# EAGLE design Warble PitchBird (EAGLE 9.6.0)
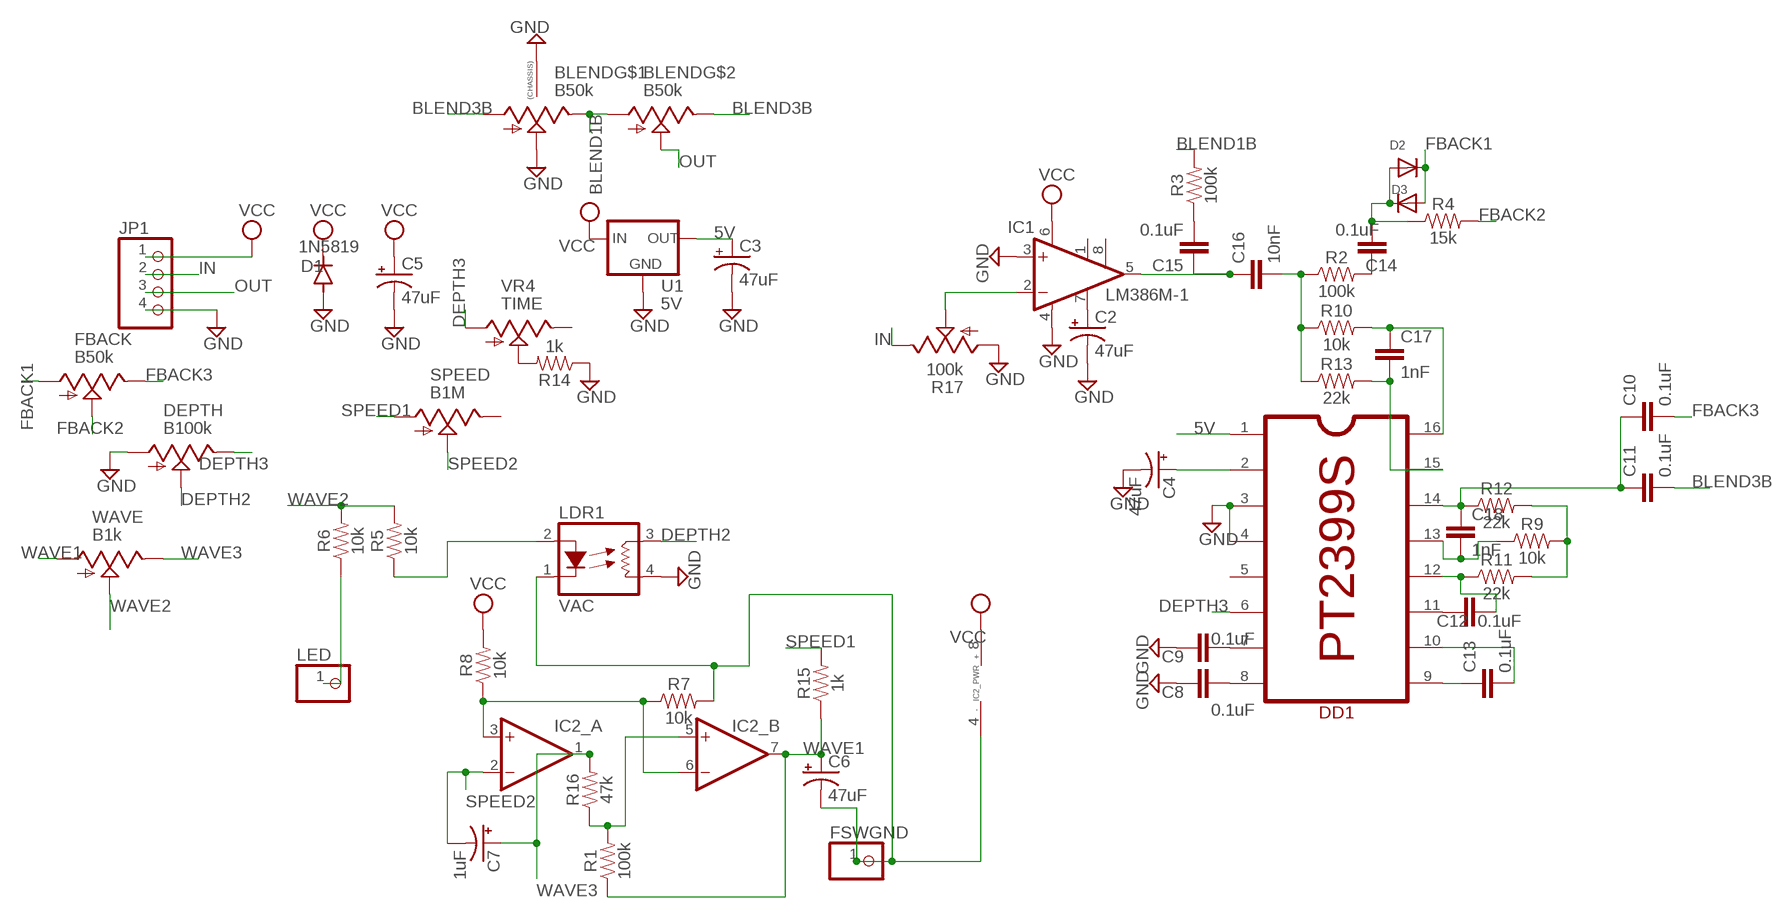
[diagram p0: schematic, sheet 1]

## Parts
BLEND  B50k  ALPHA-9MM-DUALPOT  [DUAL_9MM_SNAP-IN_POT]
C2  47uF  CAP_SMD+THRUPAN_B  [PAN_B_SMD+THRU]
C3  47uF  CAP_SMD+THRUPAN_B  [PAN_B_SMD+THRU]
C4  47uF  CAP_SMD+THRUPAN_B  [PAN_B_SMD+THRU]
C5  47uF  CAP_SMD+THRUPAN_B  [PAN_B_SMD+THRU]
C6  47uF  CAP_SMD+THRUPAN_B  [PAN_B_SMD+THRU]
C7  1uF  CAP_SMD+THRUPAN_B  [PAN_B_SMD+THRU]
C8  0.1uF  0.1UF-0603-25V-5%  [0603]
C9  0.1uF  0.1UF-0603-25V-5%  [0603]
C10  0.1uF  0.1UF-0603-25V-5%  [0603]
C11  0.1uF  0.1UF-0603-25V-5%  [0603]
C12  0.1uF  0.1UF-0603-25V-5%  [0603]
C13  0.1uF  0.1UF-0603-25V-5%  [0603]
C14  0.1uF  0.1UF-0603-25V-5%  [0603]
C15  0.1uF  0.1UF-0603-25V-5%  [0603]
C16  10nF  10NF-0603-50V-10%  [0603]
C17  1nF  1.0NF/1000PF-0603-50V-10%  [0603]
C18  1nF  1.0NF/1000PF-0603-50V-10%  [0603]
D1  1N5819  DIODE-SOD123  [SOD123]
D2  DIODESOD-123  [SOD-123]
D3  DIODESOD-123  [SOD-123]
DD1  PT2399S  [SO-16]
DEPTH  B100k  9MM_SNAP-IN_POT_  [9MM_SNAP-IN_POT]
FBACK  B50k  9MM_SNAP-IN_POT_  [9MM_SNAP-IN_POT]
FSWGND  PINHD-1X1  [1X01]
IC1  LM386M-1  [SO08]
IC2  DUALSMD  [SO08]
JP1  PINHD-1X4  [1X04]
LDR1  VAC  VACTROL_4PIN  [VACTROL_4PIN_VTL5C]
LED  PINHD-1X1  [1X01]
R1  100k  100KOHM-0603-1/10W-1%  [0603]
R2  100k  100KOHM-0603-1/10W-1%  [0603]
R3  100k  100KOHM-0603-1/10W-1%  [0603]
R4  15k  15KOHM-0603-1/10W-1%  [0603]
R5  10k  10KOHM-0603-1/10W-1%  [0603]
R6  10k  10KOHM-0603-1/10W-1%  [0603]
R7  10k  10KOHM-0603-1/10W-1%  [0603]
R8  10k  10KOHM-0603-1/10W-1%  [0603]
R9  10k  10KOHM-0603-1/10W-1%  [0603]
R10  10k  10KOHM-0603-1/10W-1%  [0603]
R11  22k  22KOHM-0603-1/10W-1%  [0603]
R12  22k  22KOHM-0603-1/10W-1%  [0603]
R13  22k  22KOHM-0603-1/10W-1%  [0603]
R14  1k  1KOHM-0603-1/10W-1%  [0603]
R15  1k  1KOHM-0603-1/10W-1%  [0603]
R16  47k  47KOHM-0603-1/10W-1%  [0603]
R17  100k  TRIM_US-PT10  [PT-10]
SPEED  B1M  9MM_SNAP-IN_POT_  [9MM_SNAP-IN_POT]
U1  5V  V_REG_78XX7812  [TO-252]
VR4  TIME  9MM_SNAP-IN_POT_  [9MM_SNAP-IN_POT]
WAVE  B1k  9MM_SNAP-IN_POT_  [9MM_SNAP-IN_POT]

## Nets
5V: C3.+ C3.++(+) DD1.1 U1.2(OUT)
BLEND1B: BLEND.1B(A) BLEND.3(E) R3.2
BLEND3B: BLEND.1(A) BLEND.3B(E) C11.2
DEPTH2: DEPTH.2(S) LDR1.3(RES1)
DEPTH3: DD1.6 DEPTH.3(E) VR4.1(A)
FBACK1: D2.C D3.A FBACK.1(A)
FBACK2: FBACK.2(S) R4.2
FBACK3: C10.2 FBACK.3(E)
GND: BLEND.2(S) BLEND.CHASSIS1 BLEND.CHASSIS2 C2.- C2.--(-) C3.- C3.--(-) C4.- C4.--(-) C5.- C5.--(-) C8.1 C9.1 D1.A DD1.3 DD1.4 DEPTH.1(A) IC1.3(+IN) IC1.4(GND) JP1.4 LDR1.4(RES2) R14.1 R17.A U1.3(GND)
IN: JP1.2 R17.E
N$1: C4.+ C4.++(+) DD1.2
N$2: LED.1 R6.1
N$3: C16.2 R2.1 R10.1 R13.1
N$4: IC1.2(-IN) R17.S
N$5: R14.2 VR4.2(S)
N$6: C2.+ C2.++(+) IC1.7(BYPASS)
N$7: C15.1 C16.1 IC1.5(OUT)
N$8: C15.2 R3.1
N$9: C17.1 DD1.16 R10.2
N$10: C17.2 DD1.15 R13.2
N$11: C14.1 R2.2
N$12: C14.2 D2.A D3.C R4.1
N$13: C13.1 DD1.9
N$14: C13.2 DD1.10
N$15: C12.1 DD1.11
N$16: C8.2 DD1.8
N$17: R9.2 R11.2 R12.2
N$18: C10.1 C11.1 C18.1 DD1.14 R12.1
N$19: C18.2 DD1.13 R9.1
N$20: C12.2 DD1.12 R11.1
N$21: C9.2 DD1.7
N$22: IC2.3(_A:+IN) IC2.6(_B:-IN) R7.1 R8.1
N$24: IC2.5(_B:+IN) R1.2 R16.1
N$25: LDR1.2(LED+) R5.1
N$28: C6.- C6.--(-) FSWGND.1 IC2.4(_PWR:V-) LDR1.1(LED-) R7.2
OUT: BLEND.2B(S) JP1.3
SPEED1: R15.2 SPEED.1(A)
SPEED2: C7.- C7.--(-) IC2.2(_A:-IN) SPEED.2(S)
VCC: C5.+ C5.++(+) D1.C IC1.6(VS) IC2.8(_PWR:V+) JP1.1 R8.2 U1.1(IN)
WAVE1: C6.+ C6.++(+) IC2.7(_B:OUT) R1.1 R15.1 WAVE.1(A)
WAVE2: R5.2 R6.2 WAVE.2(S)
WAVE3: C7.+ C7.++(+) IC2.1(_A:OUT) R16.2 WAVE.3(E)
Unconnected: DD1.5 IC1.1(GAIN) IC1.8(GAIN) SPEED.3(E) VR4.3(E)

## Library data of the parts
BLEND = MusicThingModular:ALPHA-9MM-DUALPOT: 9mm vertical snap-in pot, Alpha / Panasonic style, with a connection to the metal chassis for grounding
C2-C7 = MusicThingModular:CAP_SMD+THRU
C8-C15 = SparkFun-Capacitors:0.1UF: 0.1µF ceramic capacitors A capacitor is a passive two-terminal electrical component used to store electrical energy temporarily in an electric field.; PROD_ID: CAP-08604
C16 = SparkFun-Capacitors:10NF: 0.01uF/10nF/10,000pF ceramic capacitors A capacitor is a passive two-terminal electrical component used to store electrical energy temporarily in an electric field. CAP-09321; PROD_ID: CAP-00867
C17 C18 = SparkFun-Capacitors:1.0NF/1000PF: 1nF/1,000pF ceramic capacitors A capacitor is a passive two-terminal electrical component used to store electrical energy temporarily in an electric field.; PROD_ID: CAP-07886
D1 = diode:DIODE-: DIODE
D2 D3 = adafruit:DIODE: Diode SMADIODE - SMA Surface Mount Package 20V 1A Schottky Diode Digikey: 641-1014-6-ND DO-1N4148 - Through Hole Small Current Diode SOD-123 20V 1 A (.5mV Vf) Schottky Diode - Digikey: MBRX120TPMSCT-ND SOD-323 10V 570mA (.38mV Vf, 3ns) Schottky Diode - Digikey: ZLLS410CT-ND SOD-523 30V 30mA Schottky Diode (RB751S-40TE61) - Digikey: RB751S-40TE61CT-ND SOT23-R/W - SOT23 Package (R = Solder Paste/Reflow Ovens, W = Hand-Soldering) BAT54Film 40V 300mA - Digikey: 497-7162-1-ND
DD1 = ic-princeton-technologies:PT2399
DEPTH FBACK SPEED VR4 WAVE = MusicThingModular:9MM_SNAP-IN_POT: 9mm vertical snap-in pot, Alpha / Panasonic style
FSWGND LED = adafruit:PINHD-1X1: Pin header 1x1 for 0.1" spacing With round pins
IC1 = linear:LM386?-*: Low Voltage Audio Power Amplifier Source: http://cache.national.com/ds/LM/LM386.pdf
IC2 = integrated circuits:DUAL: OP AMP
JP1 = Connector:PINHD-1X4: PIN HEADER; CATEGORY: CONNECTOR; SUB-CATEGORY: PIN-HEADER
LDR1 = MusicThingModular:VACTROL_4PIN: 4 Pin Vactrol Resistive Photocoupler
R1-R3 = SparkFun-Resistors:100KOHM: 100kΩ resistor A resistor is a passive two-terminal electrical component that implements electrical resistance as a circuit element. Resistors act to reduce current flow, and, at the same time, act to lower voltage levels within circuits. - Wikipedia; PROD_ID: RES-07828
R4 = SparkFun-Resistors:15KOHM: 15kΩ resistor A resistor is a passive two-terminal electrical component that implements electrical resistance as a circuit element. Resistors act to reduce current flow, and, at the same time, act to lower voltage levels within circuits. - Wikipedia; PROD_ID: RES-07854
R5-R10 = SparkFun-Resistors:10KOHM: 10kΩ resistor A resistor is a passive two-terminal electrical component that implements electrical resistance as a circuit element. Resistors act to reduce current flow, and, at the same time, act to lower voltage levels within circuits. - Wikipedia; PROD_ID: RES-00824
R11-R13 = SparkFun-Resistors:22KOHM: 22kΩ resistor A resistor is a passive two-terminal electrical component that implements electrical resistance as a circuit element. Resistors act to reduce current flow, and, at the same time, act to lower voltage levels within circuits. - Wikipedia; PROD_ID: RES-07853
R14 R15 = SparkFun-Resistors:1KOHM: 1kΩ resistor A resistor is a passive two-terminal electrical component that implements electrical resistance as a circuit element. Resistors act to reduce current flow, and, at the same time, act to lower voltage levels within circuits. - Wikipedia; PROD_ID: RES-07856
R16 = SparkFun-Resistors:47KOHM: 47kΩ resistor A resistor is a passive two-terminal electrical component that implements electrical resistance as a circuit element. Resistors act to reduce current flow, and, at the same time, act to lower voltage levels within circuits. - Wikipedia; PROD_ID: RES-07871
R17 = pot:TRIM_US-: POTENTIOMETER
U1 = SparkFun-IC-Power:V_REG_78XX: Voltage Regulator Standard 78xx regulator. IGO (Input Ground Output). Spark Fun Electronics SKU : COM-00107; PROD_ID: VREG-12370; VALUE: +12v

## Board
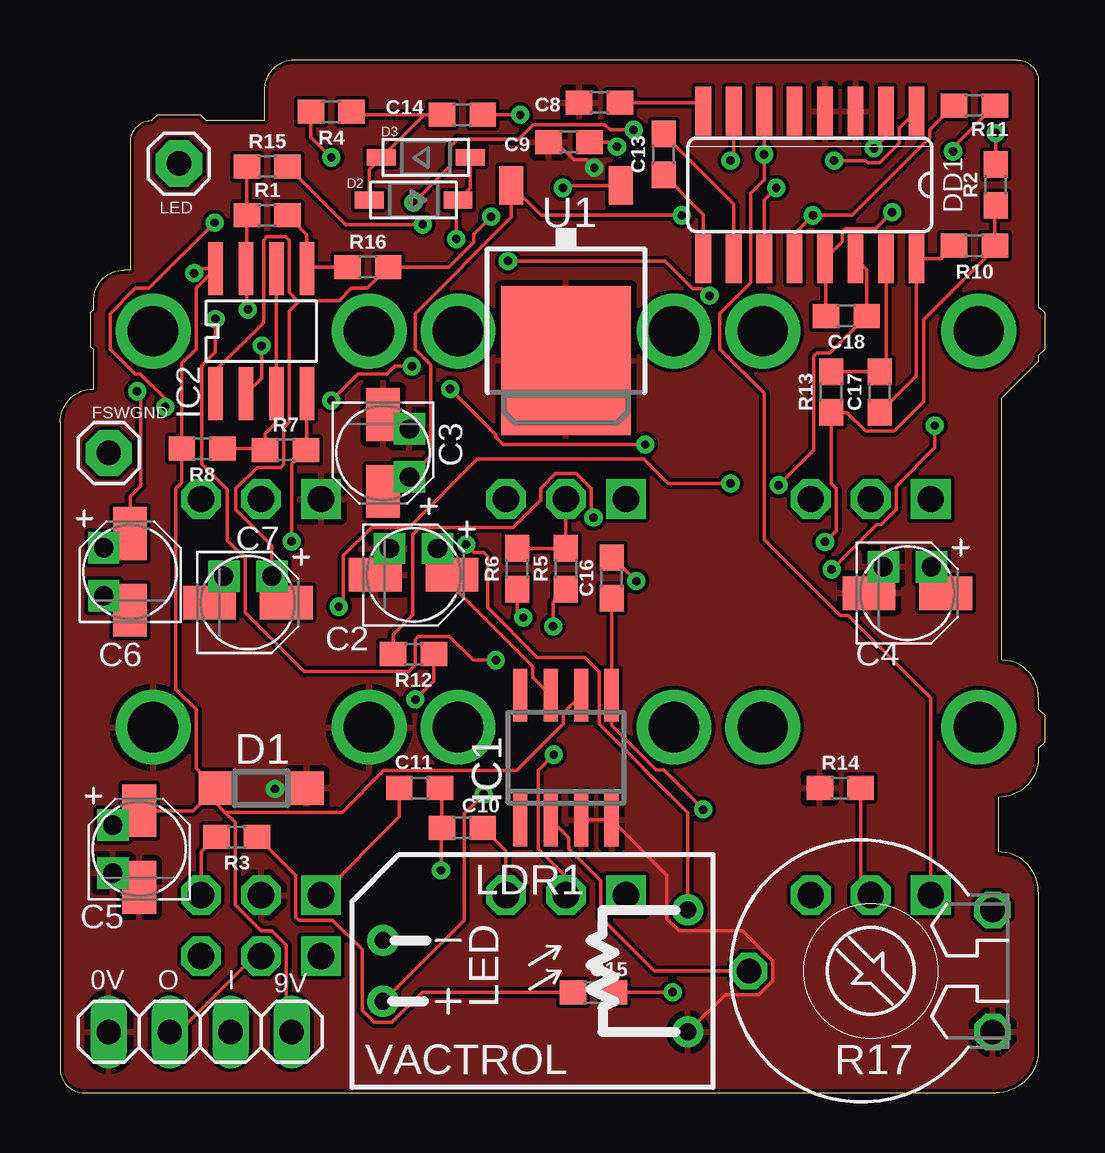
[diagram p1: board, top side]
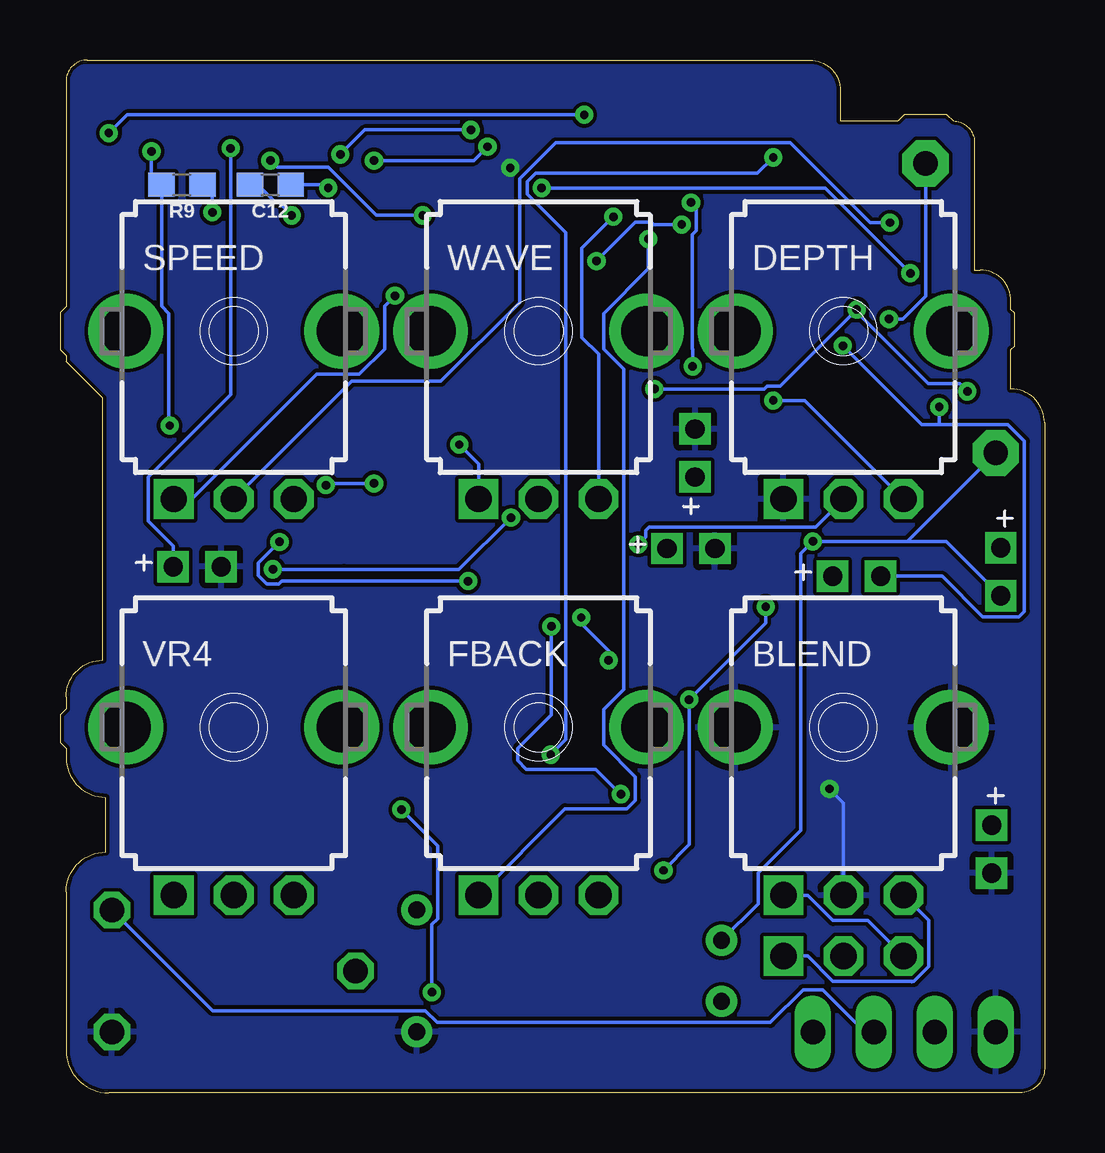
[diagram p2: board, bottom side, seen from below]

Size 41.02 x 43.05 mm. Coordinates in mm from the lower left corner, seen from the top.
Outline: 1.27,0 38.99,0 arc90 40.77,1.78 40.77,8.38 arc90 39.12,10.03 39.12,12.32 arc90 40.77,13.97 40.77,14.35 41.02,14.61 41.02,15.75 40.77,16 40.77,16.51 arc90 39.24,18.03 39.24,28.96 40.77,30.48 40.77,30.73 41.02,30.99 41.02,32.51 40.77,32.77 40.77,42.16 arc90 39.88,43.05 9.78,43.05 arc90 8.51,41.78 8.51,40.51 6.1,40.51 5.84,40.77 4.06,40.77 3.81,40.51 arc90 2.92,39.62 2.92,34.29 2.67,34.29 arc90 1.4,33.02 1.4,32.64 1.27,32.51 1.27,31.11 1.4,30.99 1.4,29.34 arc90 0,27.94 0,1.02 arc90 1.02,0 1.27,0
Copper layers (1*16): Top 0.035mm / dielectric 1.5mm / Bottom 0.035mm
Design rules "default *": minimum track width 6mil, minimum drill 0.35mm, track to track 6mil, track to pad 6mil, pad to pad 6mil, via to via 6mil, smd to smd 6mil, copper to edge 6mil, drill to drill 6mil, minimum pad ring 10mil, minimum via ring 8mil, stop-mask expansion 4mil, vias tented up to drill 0mil, thermal gap 10mil

### Footprints (pad centres in the part's own frame; a part is rotated, then mirrored left to right if it is on the bottom)
DUAL_9MM_SNAP-IN_POT = drill 1.1 square: 1 -2.5,-7; 1B -2.5,-9.54 | drill 1.1 octagon: 2 0,-7; 2B 0,-9.54; 3 2.5,-7; 3B 2.5,-9.54 | drill 2.1 pad 2.54: CHASSIS1 -4.5,0; CHASSIS2 4.5,0
PAN_B_SMD+THRU = smd 2.2 x 1.4: + 1.6,0; - -1.6,0 | drill 0.8 pad 0.9 square: ++ 1,1.1; -- -1,1.1
0603 = smd 1.1 x 1: 1 -0.85,0; 2 0.85,0
SOD123 = smd 1.4 x 1.4: A 1.9,0; C -1.9,0
SOD-123 = smd 1.2 x 0.7: A 1.85,0; C -1.85,0
SO-16 = smd 0.66 x 2.032: 1 -4.445,-3.073; 2 -3.175,-3.073; 3 -1.905,-3.073; 4 -0.635,-3.073; 5 0.635,-3.073; 6 1.905,-3.073; 7 3.175,-3.073; 8 4.445,-3.073; 9 4.445,3.073; 10 3.175,3.073; 11 1.905,3.073; 12 0.635,3.073; 13 -0.635,3.073; 14 -1.905,3.073; 15 -3.175,3.073; 16 -4.445,3.073
9MM_SNAP-IN_POT = drill 1.1 square: 1 -2.5,-7 | drill 1.1 octagon: 2 0,-7; 3 2.5,-7 | drill 2.1 pad 2.794: CHASSIS1 -4.5,0; CHASSIS2 4.5,0
1X01 = drill 1.016 pad 1.93 octagon: 1 0,0
SO08 = smd 0.6 x 2.2: 1 -1.905,-2.6; 2 -0.635,-2.6; 3 0.635,-2.6; 4 1.905,-2.6; 5 1.905,2.6; 6 0.635,2.6; 7 -0.635,2.6; 8 -1.905,2.6
1X04 = drill 1.016 long: 1 -3.81,0; 2 -1.27,0; 3 1.27,0; 4 3.81,0
VACTROL_4PIN_VTL5C = drill 0.7 pad 1.3: 1 -6.35,1.27; 2 -6.35,-1.27; 3 6.35,2.54; 4 6.35,-2.54
PT-10 = drill 1.016 octagon: A -2.54,-5.08; E 2.54,-5.08; S 0,5.08
TO-252 = smd 1 x 1.6: 1 -2.28,-4.8; 2 2.28,-4.8 | smd 5.4 x 6.2: 3 0,2.5

### Placement (x,y rotation side)
BLEND  8.38,15.24 0 bottom
C2  14.73,21.59 0 top
C3  13.46,26.67 270 top
C4  35.31,20.83 0 top
C5  3.3,10.16 90 top
C6  2.92,21.72 90 top
C7  7.83,20.43 0 top
C8  22.48,41.27 0 top
C9  21.21,39.62 0 top
C10  16.76,11.05 0 top
C11  14.99,12.7 180 top
C12  32.26,37.85 180 bottom
C13  25.15,39.12 90 top
C14  16.76,40.77 180 top
C15  22.23,4.19 180 top
C16  22.99,21.46 90 top
C17  34.16,29.21 90 top
C18  32.77,32.38 180 top
D1  8.38,12.7 0 top
D2  14.73,37.21 180 top
D3  15.24,38.99 0 top
DD1  31.24,37.85 180 top
DEPTH  8.38,31.75 0 bottom
FBACK  21.08,15.24 0 bottom
FSWGND  2.03,26.67 0 top
IC1  21.08,13.97 0 top
IC2  8.38,31.75 0 top
JP1  5.84,2.54 180 top
LDR1  19.81,5.08 0 top
LED  4.95,38.73 0 top
R1  8.64,36.58 0 top
R2  38.99,37.85 90 top
R3  7.37,10.67 180 top
R4  11.3,40.89 180 top
R5  21.08,21.84 90 top
R6  19.05,21.84 90 top
R7  9.4,26.8 0 top
R8  5.92,26.85 180 top
R9  35.94,37.85 180 bottom
R10  38.1,35.31 180 top
R11  38.1,41.15 0 top
R12  14.73,18.29 180 top
R13  32.13,29.21 90 top
R14  32.51,12.7 0 top
R15  8.64,38.61 0 top
R16  12.83,34.42 0 top
R17  33.78,5.08 90 top
SPEED  33.78,31.75 0 bottom
U1  21.08,33.02 180 top
VR4  33.78,15.24 0 bottom
WAVE  21.08,31.75 0 bottom

### Tracks (layer width: path | path; a pad name or v marks a point on that pad's centre or on a via)
5V  (via drill 0.35)
  Top 0.152: C3.+ 14.06,25.67 C3.++ 15.45,26.55 15.45,30.36 14.79,31.01 14.79,32.49 18.8,36.5 U1.2 20.05,36.58 v25.91,36.58 | v32.26,38.86 33.56,38.86 33.66,38.76 34.16,38.76 34.98,39.58 34.98,40.21 DD1.1
  Bottom 0.152: v32.26,38.86 31.97,38.58 29.84,38.58 27.84,36.58 v25.91,36.58
BLEND1B
  Top 0.152: R3.2 5.88,10.03 BLEND.3
  Bottom 0.152: BLEND.1B 9.87,5.7 8.82,4.65 5.54,4.65 5.52,4.64 5.51,4.65 5.45,4.65 4.83,5.26 4.83,7.19 BLEND.3
BLEND3B
  Top 0.152: BLEND.1 14.14,11.49 C11.2
  Bottom 0.152: BLEND.3B 7.37,7.19 8.82,7.19 9.87,8.24 BLEND.1
DEPTH2  (via drill 0.35)
  Top 0.152: v16.92,22.86 17.26,22.52 17.65,22.52 17.81,22.36 17.81,20.22 19.88,18.15 21.86,18.15 22.46,17.55 22.46,15.38 26.16,11.67 LDR1.3
  Bottom 0.152: DEPTH.2 9.54,23.59 16.46,23.59 16.61,23.44 16.61,23.17 v16.92,22.86
DEPTH3  (via drill 0.35)
  Top 0.152: DD1.6 v29.34,39.12 29.34,38.07 28.78,37.51 28.78,33.77 27.5,32.49 27.5,31.01 29.34,29.17 29.34,23.07 32.51,19.9 32.85,19.9 36.28,16.46 VR4.1 | v11.3,28.86 12.41,29.96 13.62,29.96 13.94,30.28 v14.66,30.28 | v14.73,37.11 16.26,38.64 16.26,39.43 16.58,39.75 19.11,39.75 19.71,40.35 22.7,40.35 22.92,40.14 v23.9,40.14
  Bottom 0.152: DEPTH.3 9.99,28.86 v11.3,28.86 | v14.66,30.28 14.66,31 14.67,31.01 14.67,35.78 14.51,35.94 14.51,36.89 v14.73,37.11 | v23.9,40.14 28.32,40.14 v29.34,39.12
FBACK1  (via drill 0.35)
  Top 0.152: D3.A 17.09,37.72 D2.C 16.51,37.14 v16.51,35.59
  Bottom 0.152: v16.51,35.59 16.51,34.35 18.37,32.49 18.37,31.01 17.53,30.17 17.53,16.82 18.37,15.98 18.37,14.5 17.05,13.18 17.05,12.2 17.4,11.84 19.98,11.84 FBACK.1
FBACK2  (via drill 0.35)
  Top 0.152: v11.3,38.99 10.45,39.84 R4.2 | FBACK.2 21.08,9.01 19.92,10.18 19.92,13.44 v20.57,14.1
  Bottom 0.152: v11.3,38.99 11.97,38.33 21.21,38.33 21.56,37.97 21.56,37.47 19.94,35.84 19.94,14.73 v20.57,14.1
FBACK3
  Top 0.152: C10.2 18.58,10.08 FBACK.3
GND  (via drill 0.35)
  Top 0.152: LDR1.4 27.71,4.09 29.11,4.09 29.69,4.67 29.69,5.49 28.44,6.74 25.8,6.74 25.28,7.26 25.28,9.07 IC1.4 IC1.3 | v8.96,12.67 10.25,12.67 D1.A | v22.26,38.56 21.93,38.9 21.41,38.9 20.69,39.62 C9.1 | C2.- 13.13,22.09 C2.--
  Bottom 0.152: BLEND.2 8.38,12.09 v8.96,12.67
  pour Top (isolate 0.127): 40.56,45.21 43.9,41.87 43.9,0.57 41.37,-1.96 -2.3,-1.96 -2.87,-1.38 -2.87,45.01
  pour Bottom (isolate 0.127): 40.1,-0.37 41.35,0.88 41.35,42.86 40.62,43.59 3.32,43.59 -3.02,37.26 -3.02,1.82 -0.84,-0.36 -0.84,-0.36 -0.81,-0.36 -0.85,-0.34
IN
  Bottom 0.152: JP1.2 7.49,2.54 9.24,4.29 10.06,4.29 11.42,2.93 25.31,2.93 25.8,3.42 34.66,3.42 R17.E
N$1  (via drill 0.35)
  Top 0.152: DD1.2 34.42,39.88 v33.91,39.37 | C4.+ 36.31,21.43 C4.++
  Bottom 0.152: C4.++ 36.31,22.8 37.34,23.83 37.34,25.67 33.91,29.1 v33.91,39.37
N$2  (via drill 0.35)
  Top 0.152: R6.1 19.05,20.07 v19.3,19.81 | v6.48,32.26 6.48,30.87 5.91,30.31 5.91,26.21 6.97,25.15 6.97,23.02 7.71,22.28 7.71,20.03 10.18,17.56 14.53,17.56 14.8,17.84 14.8,18.88 14.94,19.02 16.23,19.02 17.21,18.03 v18.16,18.03
  Bottom 0.152: v19.3,19.81 19.3,19.56 18.16,18.41 v18.16,18.03 | LED.1 4.95,33.21 5.9,32.26 v6.48,32.26
N$3  (via drill 0.35)
  Top 0.152: R2.1 38.95,36.96 R10.1 38.95,35.18 35.99,32.22 35.99,28.82 34.76,27.58 33.57,27.58 32.79,28.36 R13.1 32.13,25.39 32.34,25.19 32.34,23.42 v31.88,22.97 | v24.02,21.33 23.03,22.31 C16.2
  Bottom 0.152: v24.02,21.33 31.79,21.33 31.9,21.22 32.4,21.22 32.76,21.57 32.76,22.07 31.88,22.96 v31.88,22.97
N$4
  Top 0.152: R17.S 24.77,5.08 22.53,7.32 22.53,8.84 21.19,10.18 21.19,10.63 IC1.2
N$5
  Top 0.152: R14.2 33.36,8.66 VR4.2
N$6
  Top 0.152: IC1.7 19.71,17.31 19.71,17.77 16.33,21.14 C2.+ 15.73,22.19 C2.++
N$7  (via drill 0.35)
  Top 0.152: C15.1 v25.53,4.19 | v26.8,11.81 25.16,13.45 24.84,13.45 22.99,15.31 IC1.5 C16.1
  Bottom 0.152: v25.53,4.19 25.53,7.01 25.28,7.26 25.28,10.3 v26.8,11.81
N$8
  Top 0.152: R3.1 9.83,9.06 9.83,7.32 9.96,7.19 11.37,7.19 12.58,5.97 12.58,3.45 13.1,2.93 13.83,2.93 15.09,4.19 C15.2
N$9
  Top 0.152: R10.2 36.72,34.77 DD1.16 35.69,29.88 C17.1
N$10
  Top 0.152: R13.2 C17.2 34.42,30.31 DD1.15
N$11  (via drill 0.35)
  Top 0.152: C14.1 v19.18,40.77 | v38.99,40.01 R2.2
  Bottom 0.152: v19.18,40.77 38.23,40.77 v38.99,40.01
N$12
  Top 0.152: D2.A 12.88,38.48 D3.C 15.17,40.77 C14.2 12.28,40.77 R4.1
N$13
  Top 0.152: C13.1 26.8,36.62 DD1.9
N$14
  Top 0.152: C13.2 28.07,37.05 DD1.10
N$15  (via drill 0.35)
  Top 0.152: DD1.11 29.34,37.21 v29.84,37.72
  Bottom 0.152: v29.84,37.72 29.97,37.85 C12.1
N$16
  Top 0.152: C8.2 26.44,41.27 DD1.8
N$17  (via drill 0.35)
  Top 0.152: R11.2 37.21,39.41 v37.21,39.24 | v32.15,21.82 34.02,23.7 34.22,23.7 34.84,24.31 34.84,25.28 36.45,26.89 v36.45,27.81 | v22.23,23.98 22.14,24.07 22.14,25.19 21.52,25.8 20.65,25.8 20.03,25.19 20.03,24.71 18.89,23.57 14.98,23.57 14.69,23.28 14.69,19.91 13.88,19.11 R12.2
  Bottom 0.152: v37.21,39.24 37.21,38.27 R9.2 36.79,32.79 36.49,32.49 36.49,27.86 v36.45,27.81 | v32.15,21.82 29.2,21.82 29.18,21.81 24.4,21.81 v22.23,23.98
N$18  (via drill 0.35)
  Top 0.152: DD1.14 33.62,34.3 C18.1 32.07,30.84 31.54,30.84 31.4,30.7 31.4,26.79 v29.94,25.33 | C11.1 15.91,12.62 C10.1 15.88,11.01 v15.88,9.27 | R12.1 15.58,17.17 v14.81,16.39 | v11.62,20.26 11.8,20.45 11.8,22.39 12.98,23.57 14.55,23.57 17.39,26.41 24.32,26.41 25.34,25.4 v27.94,25.4
  Bottom 0.152: v15.88,9.27 14.79,10.35 14.79,16.38 v14.81,16.39 11.62,19.58 v11.62,20.26 | v27.94,25.4 29.87,25.4 v29.94,25.33
N$19  (via drill 0.35)
  Top 0.152: C18.2 31.92,34.73 DD1.13 32.59,35.48 32.59,35.88 32.72,36.02 33.98,36.02 v34.67,36.7
  Bottom 0.152: R9.1 34.67,37.43 v34.67,36.7
N$20  (via drill 0.35)
  Top 0.152: DD1.12 30.61,35.81 v31.37,36.58 33.01,36.58 36.25,39.81 36.25,40.14 R11.1
  Bottom 0.152: v31.37,36.58 31.91,37.12 32.05,37.12 32.78,37.85 C12.2
N$21  (via drill 0.35)
  Top 0.152: DD1.7 28.07,38.99 v27.94,38.86 | C9.2 23.02,39.62 v23.21,39.44
  Bottom 0.152: v27.94,38.86 23.78,38.86 v23.21,39.44
N$22
  Top 0.152: R8.1 8.49,26.85 R7.1 8.55,27.47 9.02,27.94 IC2.3 IC2.6
N$24
  Top 0.152: R16.1 10.35,34.42 IC2.5 10.29,35.77 R1.2
N$25  (via drill 0.35)
  Top 0.152: v17.65,12.45 16.98,11.78 16.97,11.78 16.84,11.64 16.84,7.18 LDR1.2 | v20.55,19.45 20.55,20.46 R5.1
  Bottom 0.152: v17.65,12.45 18.7,13.49 21.59,13.49 21.94,13.85 21.94,14.35 20.55,15.74 v20.55,19.45
N$28  (via drill 0.35)
  Top 0.152: IC2.4 10.29,26.84 R7.2 9.65,26.2 v9.65,22.99 | C6.-- 2.32,20.72 C6.-
  Bottom 0.152: LDR1.1 11.94,7.88 11.94,9.16 10.16,10.93 10.16,22.48 v9.65,22.99 5.71,22.99 | FSWGND.1 5.71,22.99 | C6.-- 4.09,22.99 5.71,22.99
OUT
  Top 0.152: BLEND.2B 8.11,5.7 4.95,2.54 JP1.3
SPEED1  (via drill 0.35)
  Top 0.152: R15.2 11.9,36.2 v15.11,36.2 | v27.06,33.23 26.76,33.53 26.37,33.53 25.23,34.67 v18.67,34.67
  Bottom 0.152: v15.11,36.2 16.29,36.2 16.39,36.29 17.05,36.29 v18.67,34.67 | SPEED.1 35.54,24.75 30.32,29.96 28.54,29.96 27.5,31.01 27.5,32.79 v27.06,33.23
SPEED2  (via drill 0.35)
  Top 0.152: C7.- 6.23,20.93 C7.-- | v8.4,31.14 8.4,29.8 IC2.2 | v4.38,28.59 4.38,28.93 3.35,29.96 3.14,29.96 2.1,31.01 2.1,32.49 3.14,33.54 3.71,33.54 v6.44,36.27
  Bottom 0.152: C7.-- 4.27,21.53 2.57,19.83 1.07,19.83 0.84,20.07 0.84,27.16 1.54,27.86 4.41,27.86 | v8.4,31.14 5.12,27.86 4.41,27.86 | SPEED.2 28.87,29.66 25.15,29.66 21.87,32.94 21.87,38.1 20.37,39.6 10.59,39.6 7.27,36.27 v6.44,36.27 | v4.38,28.59 4.38,27.89 4.41,27.86
VCC  (via drill 0.35)
  Top 0.152: D1.C 5.54,11.76 3.35,11.76 | 3.35,11.76 C5.+ | IC1.6 20.98,15.83 20.98,15.38 19.03,13.43 13.49,13.43 11.75,11.69 6.87,11.69 | U1.1 21.06,37.82 v20.95,37.72 | v5.59,34.16 5.78,34.35 IC2.8 5.67,33.54 5.67,31.01 5.07,30.41 R8.2 5.07,25.43 4.83,25.19 4.83,16.82 5.67,15.98 5.67,13.51 D1.C | D1.C 6.48,12.07 6.87,11.69 | 6.87,11.69 7.29,11.26 7.29,7.84 8.38,6.75 8.82,6.75 9.44,6.14 9.44,2.76 JP1.1 | C5.++ 2.75,11.16 3.35,11.76
  Bottom 0.152: v20.95,37.72 9.14,37.72 v5.59,34.16
WAVE1  (via drill 0.35)
  Top 0.152: 7.79,34.39 R1.1 R15.1 | 7.79,34.39 IC2.7 | 7.79,34.39 7.79,32.7 v7.83,32.65 | C6.+ 2.92,24.86 3.37,25.3 3.37,28.96 3.21,29.11 v3.21,29.24 | v16.26,29.34 18.15,27.44 18.15,27.32 18.46,27.02 v24.38,27.02
  Top 0.254: C6.+ 2.32,22.72 C6.++
  Bottom 0.152: v3.21,29.24 3.53,29.55 4.84,29.55 7.83,32.54 v7.83,32.65 11.02,29.46 11.55,29.46 11.68,29.34 v16.26,29.34 | WAVE.1 23.58,26.22 v24.38,27.02
WAVE2
  Top 0.152: R5.2 R6.2 | 21.44,23.05 R5.2 | WAVE.2 R5.2
WAVE3  (via drill 0.35)
  Top 0.152: 9.98,33.02 11.63,33.02 12.14,33.54 12.8,33.54 R16.2 16.2,34.42 17.24,35.46 17.24,35.8 v17.96,36.52 | 9.98,33.02 9.89,33.02 9.55,33.37 9.55,35.55 9.41,35.68 8.62,35.68 8.49,35.55 8.49,32.11 6.48,30.1 IC2.1 | C7.+ 8.83,21.03 C7.++ 8.83,22.82 7.33,24.31 7.33,25.19 8.21,26.07 9.19,26.07 9.33,26.2 9.33,27.74 9.55,27.95 9.55,32.58 9.98,33.02
  Bottom 0.152: v17.96,36.52 19.28,35.21 19.28,31.49 18.58,30.79 WAVE.3

### Text on the board
tNames: 0V | O | I | 9V